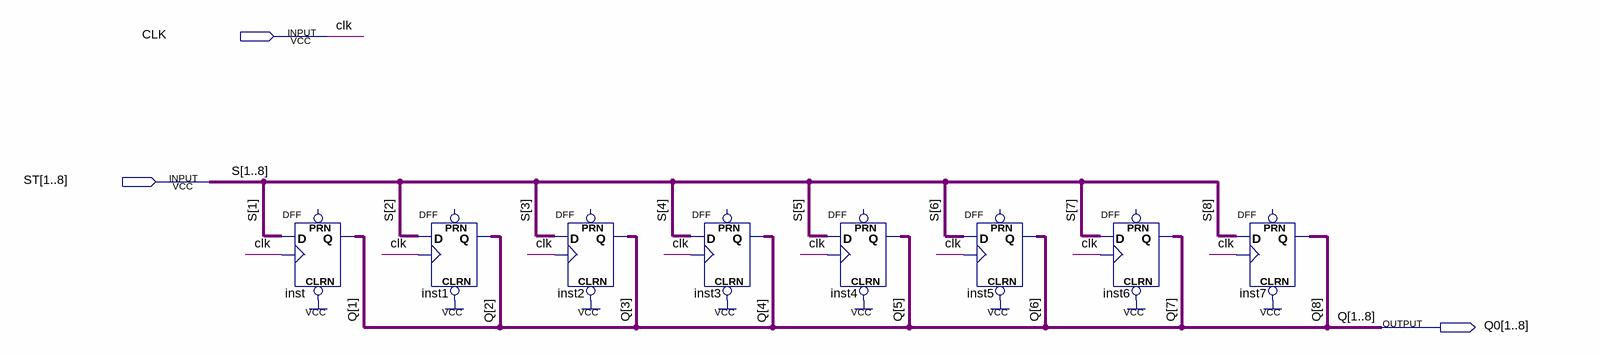
[diagram p0: schematic sheet]
// Quartus schematic Acumulador Temp.bdf as structural Verilog: 8 symbols, 3 pins
module \Acumulador_Temp  (
  input  CLK,
  input  [1:8] ST,
  output [1:8] Q0
);

  DFF inst (.CLRN(1'b1), .CLK(CLK), .D(ST[1]), .Q(Q0[1]));  // open: PRN
  DFF inst1 (.CLRN(1'b1), .CLK(CLK), .D(ST[2]), .Q(Q0[2]));  // open: PRN
  DFF inst2 (.CLRN(1'b1), .CLK(CLK), .D(ST[3]), .Q(Q0[3]));  // open: PRN
  DFF inst3 (.CLRN(1'b1), .CLK(CLK), .D(ST[4]), .Q(Q0[4]));  // open: PRN
  DFF inst4 (.CLRN(1'b1), .CLK(CLK), .D(ST[5]), .Q(Q0[5]));  // open: PRN
  DFF inst5 (.CLRN(1'b1), .CLK(CLK), .D(ST[6]), .Q(Q0[6]));  // open: PRN
  DFF inst6 (.CLRN(1'b1), .CLK(CLK), .D(ST[7]), .Q(Q0[7]));  // open: PRN
  DFF inst7 (.CLRN(1'b1), .CLK(CLK), .D(ST[8]), .Q(Q0[8]));  // open: PRN

  // Other names for the same wires on the sheet: Q[8:1] = {Q0[8], Q0[7], Q0[6], Q0[5], Q0[4], Q0[3], Q0[2], Q0[1]};
  //   S[8:1] = {ST[8], ST[7], ST[6], ST[5], ST[4], ST[3], ST[2], ST[1]}
endmodule
